# EAGLE design untitled (EAGLE 7.7.0)
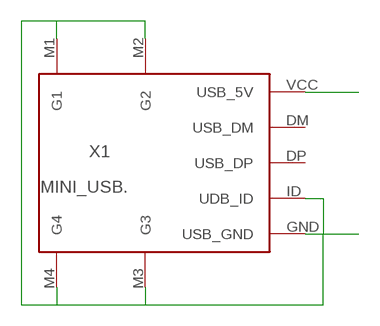
[diagram p0: schematic, sheet 1]

## Parts
X1  MINI_USB.  [32005-201]

## Nets
+5V: X1.VCC(USB_5V)
GND: X1.GND(USB_GND) X1.ID(UDB_ID) X1.M1(G1) X1.M2(G2) X1.M3(G3) X1.M4(G4)
Unconnected: X1.DM(USB_DM) X1.DP(USB_DP)

## Library data of the parts
X1 = connectors:MINI_USB

## Board
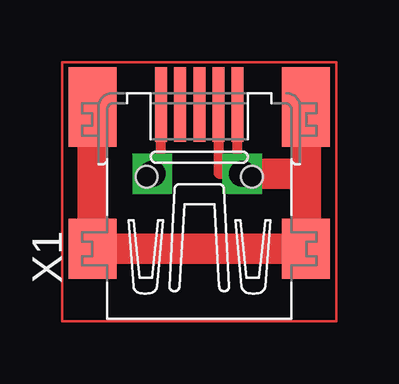
[diagram p1: board, top side]

No outline drawn. Coordinates in mm, seen from the top.
Copper layers (1*16): Top 0.035mm / dielectric 1.5mm / Bottom 0.035mm
Design rules "default": minimum track width 10mil, minimum drill 24mil, track to track 8mil, track to pad 8mil, pad to pad 8mil, via to via 8mil, smd to smd 8mil, copper to edge 40mil, drill to drill 8mil, minimum pad ring 10mil, minimum via ring 8mil, stop-mask expansion 4mil, vias tented up to drill 0mil, thermal gap 10mil

### Footprints (pad centres in the part's own frame; a part is rotated, then mirrored left to right if it is on the bottom)
32005-201 = smd 3.1 x 0.5: DM 3,0.8; DP 3,0; GND 3,-1.6; ID 3,-0.8; VCC 3,1.6 | smd 2.5 x 2: M1 -3,-4.45; M2 -3,4.45 | smd 3.3 x 2: M3 2.9,4.45; M4 2.9,-4.45 | hole 0.9: 0,2.2; 0,-2.2

### Placement (x,y rotation side)
X1  5.08,5.71 90 top

### Tracks (layer width: path | path; a pad name or v marks a point on that pad's centre or on a via)
+5V  (via drill 1.1)
  Top 0.406: v3.12,5.84 3.48,5.84 X1.VCC
GND  (via drill 1.1)
  Top 0.406: X1.GND 6.68,5.84 v6.87,5.84 5.88,5.84 X1.ID
  Top 1.27: X1.M3 X1.M2 X1.M1 X1.M4 9.53,5.84 v6.87,5.84
N$1
  Top 0.1: -0.64,10.48 10.79,10.48 10.79,-0.32 -0.64,-0.32 -0.64,10.48